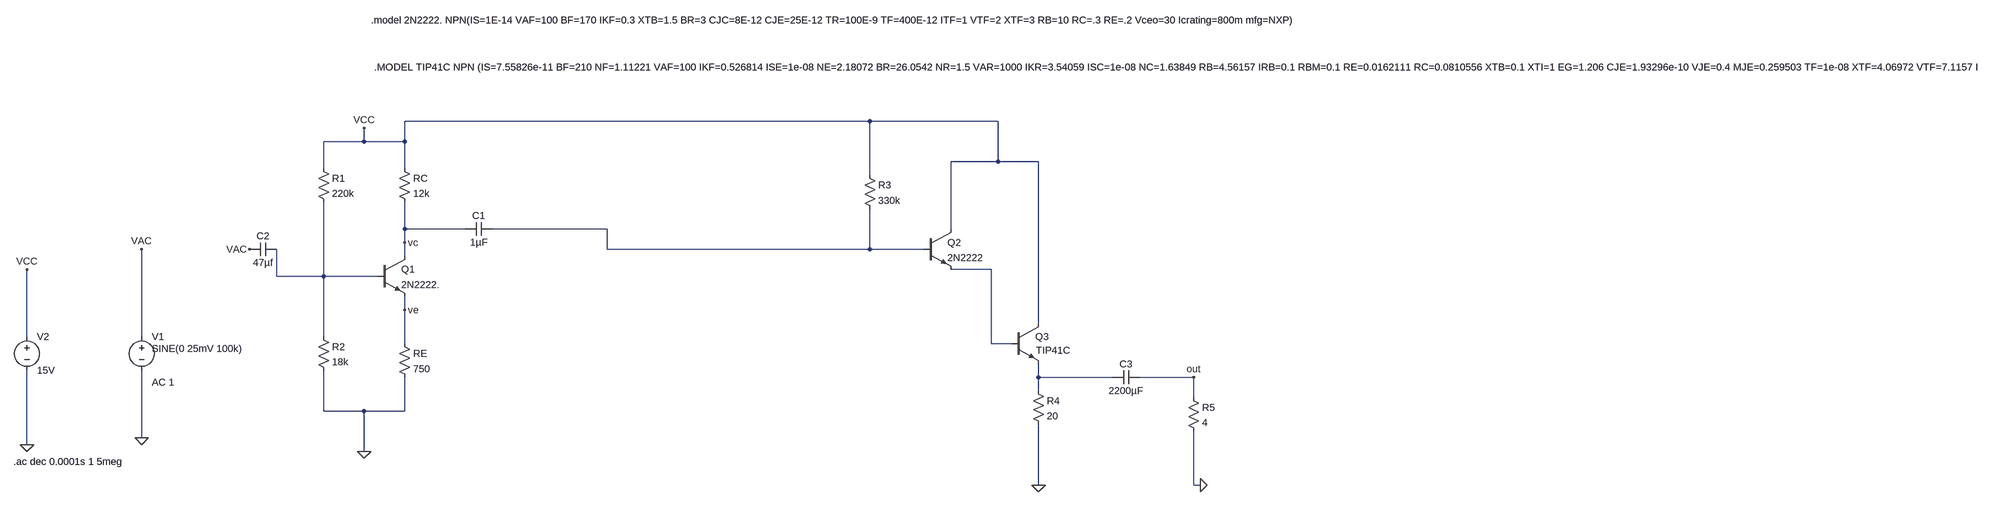
[diagram p0: schematic Draft8.asc]
Draft8.asc, the LTspice schematic file:
Version 4
SHEET 1 7756 904
WIRE 1344 -176 240 -176
WIRE 1648 -176 1344 -176
WIRE 144 -128 144 -160
WIRE 144 -128 48 -128
WIRE 240 -128 240 -176
WIRE 240 -128 144 -128
WIRE 1648 -80 1648 -176
WIRE 1648 -80 1536 -80
WIRE 1744 -80 1648 -80
WIRE 48 -64 48 -128
WIRE 240 -64 240 -128
WIRE 1344 -48 1344 -176
WIRE 240 80 240 16
WIRE 384 80 240 80
WIRE 720 80 448 80
WIRE 1536 80 1536 -80
WIRE 240 112 240 80
WIRE 720 128 720 80
WIRE 1344 128 1344 32
WIRE 1344 128 720 128
WIRE 1472 128 1344 128
WIRE 240 144 240 112
WIRE 1632 176 1536 176
WIRE -64 192 -64 128
WIRE 48 192 48 16
WIRE 48 192 -64 192
WIRE 176 192 48 192
WIRE 240 272 240 240
WIRE 1744 304 1744 -80
WIRE -656 336 -656 176
WIRE -384 336 -384 128
WIRE 48 336 48 192
WIRE 240 352 240 272
WIRE 1632 352 1632 176
WIRE 1680 352 1632 352
WIRE 1744 432 1744 400
WIRE 1920 432 1744 432
WIRE 2112 432 1984 432
WIRE 1744 464 1744 432
WIRE 2112 480 2112 432
WIRE 48 512 48 416
WIRE 144 512 48 512
WIRE 240 512 240 432
WIRE 240 512 144 512
WIRE -384 576 -384 416
WIRE -656 592 -656 416
WIRE 144 608 144 512
WIRE 1744 688 1744 544
WIRE 2112 688 2112 560
WIRE 2128 688 2112 688
FLAG 144 608 0
FLAG -384 576 0
FLAG 144 -160 VCC
FLAG -656 592 0
FLAG -656 176 VCC
FLAG 240 112 vc
FLAG 240 272 ve
FLAG 1744 688 0
FLAG 2128 688 0
FLAG 2112 432 out
FLAG -384 128 VAC
FLAG -128 128 VAC
SYMBOL res 224 -80 R0
SYMATTR InstName RC
SYMATTR Value 12k
SYMBOL res 32 -80 R0
SYMATTR InstName R1
SYMATTR Value 220k
SYMBOL res 32 320 R0
SYMATTR InstName R2
SYMATTR Value 18k
SYMBOL res 224 336 R0
SYMATTR InstName RE
SYMATTR Value 750
SYMBOL voltage -384 320 R0
WINDOW 123 24 124 Left 2
WINDOW 39 0 0 Left 0
WINDOW 3 24 44 Left 2
SYMATTR Value2 AC 1
SYMATTR Value SINE(0 25mV 100k)
SYMATTR InstName V1
SYMBOL voltage -656 320 R0
WINDOW 123 0 0 Left 0
WINDOW 39 0 0 Left 0
SYMATTR InstName V2
SYMATTR Value 15V
SYMBOL cap 448 64 R90
WINDOW 0 0 32 VBottom 2
WINDOW 3 32 32 VTop 2
SYMATTR InstName C1
SYMATTR Value 1µF
SYMBOL cap -64 112 R90
WINDOW 0 0 32 VBottom 2
WINDOW 3 32 32 VTop 2
SYMATTR InstName C2
SYMATTR Value 47µf
SYMBOL npn 176 144 R0
SYMATTR InstName Q1
SYMATTR Value 2N2222.
SYMBOL res 1328 -64 R0
SYMATTR InstName R3
SYMATTR Value 330k
SYMBOL npn 1472 80 R0
SYMATTR InstName Q2
SYMATTR Value 2N2222
SYMBOL npn 1680 304 R0
WINDOW 3 58 64 Left 2
SYMATTR Value TIP41C
SYMATTR InstName Q3
SYMBOL res 1728 448 R0
SYMATTR InstName R4
SYMATTR Value 20
SYMBOL cap 1984 416 R90
WINDOW 0 0 32 VBottom 2
WINDOW 3 32 32 VTop 2
SYMATTR InstName C3
SYMATTR Value 2200µF
SYMBOL res 2096 464 R0
SYMATTR InstName R5
SYMATTR Value 4
TEXT -688 632 Left 2 !.ac dec 0.0001s 1 5meg
TEXT 160 -448 Left 2 !.model 2N2222. NPN(IS=1E-14 VAF=100 BF=170 IKF=0.3 XTB=1.5 BR=3 CJC=8E-12 CJE=25E-12 TR=100E-9 TF=400E-12 ITF=1 VTF=2 XTF=3 RB=10 RC=.3 RE=.2 Vceo=30 Icrating=800m mfg=NXP)
TEXT 168 -336 Left 2 !.MODEL TIP41C NPN (IS=7.55826e-11 BF=210 NF=1.11221 VAF=100 IKF=0.526814 ISE=1e-08 NE=2.18072 BR=26.0542 NR=1.5 VAR=1000 IKR=3.54059 ISC=1e-08 NC=1.63849 RB=4.56157 IRB=0.1 RBM=0.1 RE=0.0162111 RC=0.0810556 XTB=0.1 XTI=1 EG=1.206 CJE=1.93296e-10 VJE=0.4 MJE=0.259503 TF=1e-08 XTF=4.06972 VTF=7.1157 ITF=0.001 CJC=1.09657e-10 VJC=0.730921 MJC=0.23 XCJC=0.803085 FC=0.8 TR=9.01013e-08 PTF=0 Vceo=100 ICrating=6 mfg=ON_Semi)

The netlist it stands for:
* Draft8.asc
RC VCC vc 12k
R1 VCC N003 220k
R2 N003 0 18k
RE ve 0 750
V1 VAC 0 SINE(0 25mV 100k) AC 1
V2 VCC 0 15V
C1 N001 vc 1µF
C2 N003 VAC 47µf
Q1 vc N003 ve 0 2N2222.
R3 VCC N001 330k
Q2 VCC N001 N002 0 2N2222
Q3 VCC N002 N004 0 TIP41C
R4 N004 0 20
C3 out N004 2200µF
R5 out 0 4
.model NPN NPN
.model PNP PNP
.lib standard.bjt
.ac dec 0.0001s 1 5meg
.model 2N2222. NPN(IS=1E-14 VAF=100 BF=170 IKF=0.3 XTB=1.5 BR=3 CJC=8E-12 CJE=25E-12 TR=100E-9 TF=400E-12 ITF=1 VTF=2 XTF=3 RB=10 RC=.3 RE=.2 Vceo=30 Icrating=800m mfg=NXP)
.MODEL TIP41C NPN (IS=7.55826e-11 BF=210 NF=1.11221 VAF=100 IKF=0.526814 ISE=1e-08 NE=2.18072 BR=26.0542 NR=1.5 VAR=1000 IKR=3.54059 ISC=1e-08 NC=1.63849 RB=4.56157 IRB=0.1 RBM=0.1 RE=0.0162111 RC=0.0810556 XTB=0.1 XTI=1 EG=1.206 CJE=1.93296e-10 VJE=0.4 MJE=0.259503 TF=1e-08 XTF=4.06972 VTF=7.1157 ITF=0.001 CJC=1.09657e-10 VJC=0.730921 MJC=0.23 XCJC=0.803085 FC=0.8 TR=9.01013e-08 PTF=0 Vceo=100 ICrating=6 mfg=ON_Semi)
.backanno
.end